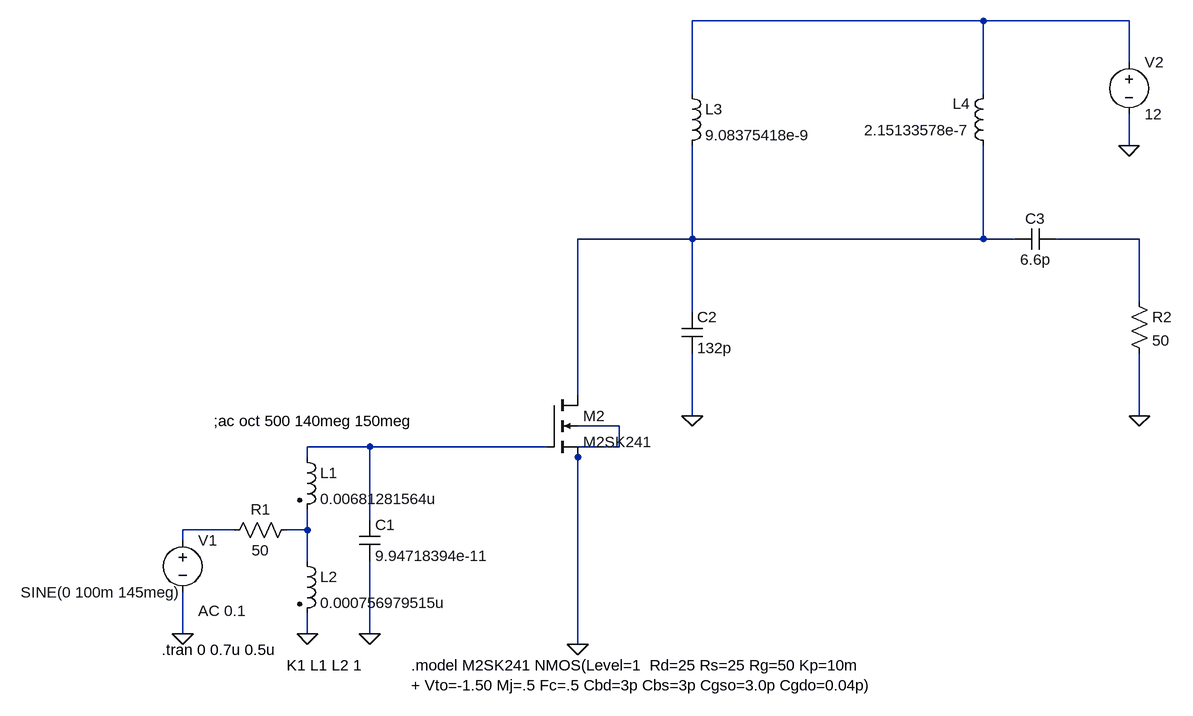
[diagram p0: schematic RF Preamp.asc]
RF Preamp.asc, the LTspice schematic file:
Version 4
SHEET 1 1464 680
WIRE 1168 -592 720 -592
WIRE 1392 -592 1168 -592
WIRE 1392 -528 1392 -592
WIRE 720 -480 720 -592
WIRE 1168 -480 1168 -592
WIRE 1392 -400 1392 -448
WIRE 720 -256 720 -400
WIRE 720 -256 544 -256
WIRE 1168 -256 1168 -400
WIRE 1168 -256 720 -256
WIRE 1216 -256 1168 -256
WIRE 1408 -256 1280 -256
WIRE 1408 -160 1408 -256
WIRE 720 -144 720 -256
WIRE 544 -16 544 -256
WIRE 720 16 720 -80
WIRE 1408 16 1408 -80
WIRE 608 32 544 32
WIRE 224 64 128 64
WIRE 496 64 224 64
WIRE 608 64 608 32
WIRE 608 64 544 64
WIRE 128 80 128 64
WIRE 544 80 544 64
WIRE 224 176 224 64
WIRE 16 192 -64 192
WIRE 128 192 128 160
WIRE 128 192 96 192
WIRE -64 208 -64 192
WIRE 128 240 128 192
WIRE -64 352 -64 288
WIRE 128 352 128 320
WIRE 224 352 224 240
WIRE 544 368 544 80
WIRE 544 368 528 368
FLAG 128 352 0
FLAG -64 352 0
FLAG 224 352 0
FLAG 544 368 0
FLAG 720 16 0
FLAG 1408 16 0
FLAG 1392 -400 0
SYMBOL res 112 176 R90
WINDOW 0 0 56 VBottom 2
WINDOW 3 32 56 VTop 2
SYMATTR InstName R1
SYMATTR Value 50
SYMBOL voltage -64 192 R0
WINDOW 3 -249 96 Left 2
WINDOW 123 24 124 Left 2
WINDOW 39 0 0 Left 2
SYMATTR Value SINE(0 100m 145meg)
SYMATTR Value2 AC 0.1
SYMATTR InstName V1
SYMBOL cap 208 176 R0
SYMATTR InstName C1
SYMATTR Value 9.94718394e-11
SYMBOL ind2 112 64 R0
SYMATTR InstName L1
SYMATTR Value 0.00681281564u
SYMATTR Type ind
SYMBOL ind2 112 224 R0
SYMATTR InstName L2
SYMATTR Value 0.000756979515u
SYMATTR Type ind
SYMBOL nmos4 496 -16 R0
SYMATTR InstName M2
SYMATTR Value M2SK241
SYMBOL res 1392 -176 R0
SYMATTR InstName R2
SYMATTR Value 50
SYMBOL cap 704 -144 R0
SYMATTR InstName C2
SYMATTR Value 132p
SYMBOL ind 704 -496 R0
SYMATTR InstName L3
SYMATTR Value 9.08375418e-9
SYMBOL voltage 1392 -544 R0
WINDOW 123 0 0 Left 2
WINDOW 39 0 0 Left 2
SYMATTR InstName V2
SYMATTR Value 12
SYMBOL cap 1216 -272 M90
WINDOW 0 0 32 VBottom 2
WINDOW 3 32 32 VTop 2
SYMATTR InstName C3
SYMATTR Value 6.6p
SYMBOL ind 1184 -384 R180
WINDOW 0 36 80 Left 2
WINDOW 3 36 40 Left 2
SYMATTR InstName L4
SYMATTR Value 2.15133578e-7
TEXT -16 24 Left 2 !;ac oct 500 140meg 150meg
TEXT -96 376 Left 2 !.tran 0 0.7u 0.5u
TEXT 96 400 Left 2 !K1 L1 L2 1
TEXT 288 400 Left 2 !.model M2SK241 NMOS(Level=1  Rd=25 Rs=25 Rg=50 Kp=10m\n+ Vto=-1.50 Mj=.5 Fc=.5 Cbd=3p Cbs=3p Cgso=3.0p Cgdo=0.04p)

The netlist it stands for:
* RF Preamp.asc
R1 N006 N005 50
V1 N005 0 SINE(0 100m 145meg) AC 0.1
C1 N004 0 9.94718394e-11
L1 N004 N006 0.00681281564u
L2 N006 0 0.000756979515u
M2 N002 N004 0 0 M2SK241
R2 N003 0 50
C2 N002 0 132p
L3 N001 N002 9.08375418e-9
V2 N001 0 12
C3 N002 N003 6.6p
L4 N002 N001 2.15133578e-7
.model NMOS NMOS
.model PMOS PMOS
.lib standard.mos
;ac oct 500 140meg 150meg
.tran 0 0.7u 0.5u
K1 L1 L2 1
.model M2SK241 NMOS(Level=1  Rd=25 Rs=25 Rg=50 Kp=10m
+ Vto=-1.50 Mj=.5 Fc=.5 Cbd=3p Cbs=3p Cgso=3.0p Cgdo=0.04p)
.backanno
.end